# EAGLE schematic Suspension Alignment Tool (EAGLE 9.5.0)
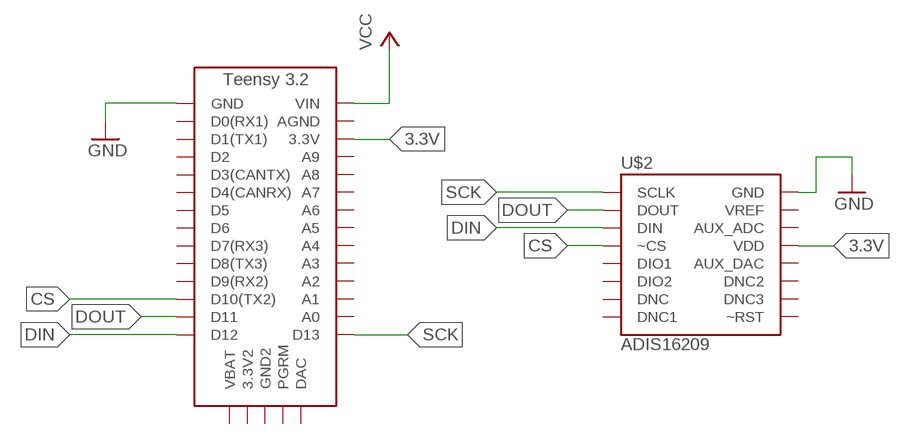
[diagram p0: schematic, sheet 1]

## Parts
U$1  TEENSY_3.2_EXT  [TEENSY_3.2_EXT]
U$2  ADIS16209  [CC-16-2]

## Nets
3.3V: U$1.3.3V U$2.P$13(VDD)
CS: U$1.D10(TX2) U$2.P$4(~CS)
DIN: U$1.D12 U$2.P$3(DIN)
DOUT: U$1.D11 U$2.P$2(DOUT)
GND: U$1.GND U$2.P$16(GND)
SCK: U$1.D13 U$2.P$1(SCLK)
VCC: U$1.VIN
Unconnected: U$1.3.3V2 U$1.A0 U$1.A1 U$1.A2 U$1.A3 U$1.A4 U$1.A5 U$1.A6 U$1.A7 U$1.A8 U$1.A9 U$1.AGND U$1.D0(RX1) U$1.D1(TX1) U$1.D2 U$1.D3(CANTX) U$1.D4(CANRX) U$1.D5 U$1.D6 U$1.D7(RX3) U$1.D8(TX3) U$1.D9(RX2) U$1.DAC U$1.GND2 U$1.PGRM U$1.VBAT U$2.P$5(DIO1) U$2.P$6(DIO2) U$2.P$7(DNC) U$2.P$8(DNC1) U$2.P$9(~RST) U$2.P$10(DNC3) U$2.P$11(DNC2) U$2.P$12(AUX_DAC) U$2.P$14(AUX_ADC) U$2.P$15(VREF)

## Library data of the parts
U$1 = HyTechDevices:TEENSY_3.2_EXT: Version of the Teensy LC board that uses the 2 main rows of pins and the pins opposite the usb port.
U$2 = HyTechDevices:ADIS16209: Analog Devices ADIS16209 High Accuracy, Dual-Axis Digital Inclinometer and Accelerometer